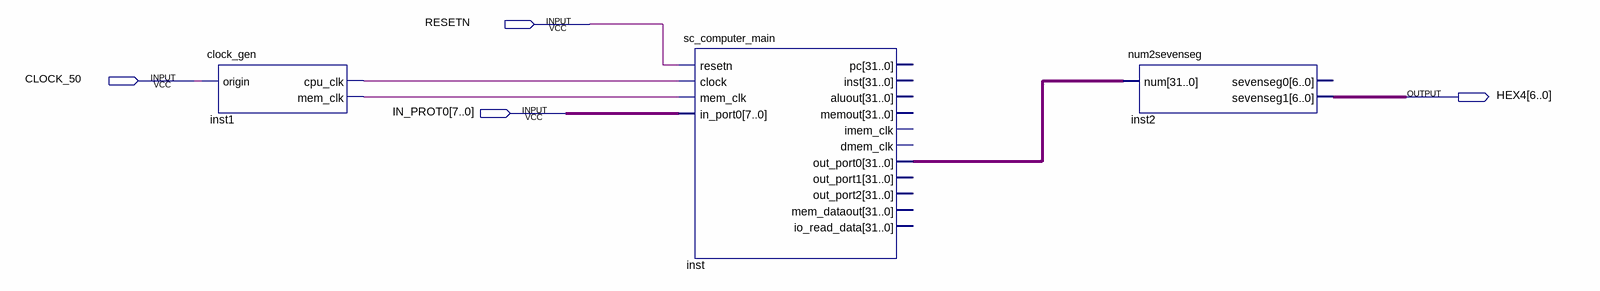
[diagram p0: schematic sheet]
// Quartus schematic sc_computer.bdf as structural Verilog: 3 symbols, 4 pins
module sc_computer (
  input  RESETN,
  input  CLOCK_50,
  input  [7:0] IN_PROT0,
  output [6:0] HEX4
);

  wire inst1_cpu_clk, inst1_mem_clk;
  wire [31:0] inst_out_port0;

  clock_gen inst1 (.origin(CLOCK_50), .cpu_clk(inst1_cpu_clk), .mem_clk(inst1_mem_clk));
  sc_computer_main inst (
    .resetn(RESETN), .clock(inst1_cpu_clk), .mem_clk(inst1_mem_clk), .in_port0(IN_PROT0),
    .out_port0(inst_out_port0));  // open: pc, inst, aluout, memout, imem_clk, dmem_clk, out_port1, out_port2, mem_dataout, io_read_data
  num2sevenseg inst2 (.num(inst_out_port0), .sevenseg1(HEX4));  // open: sevenseg0
endmodule
